# EAGLE schematic router (EAGLE 9.6.2)
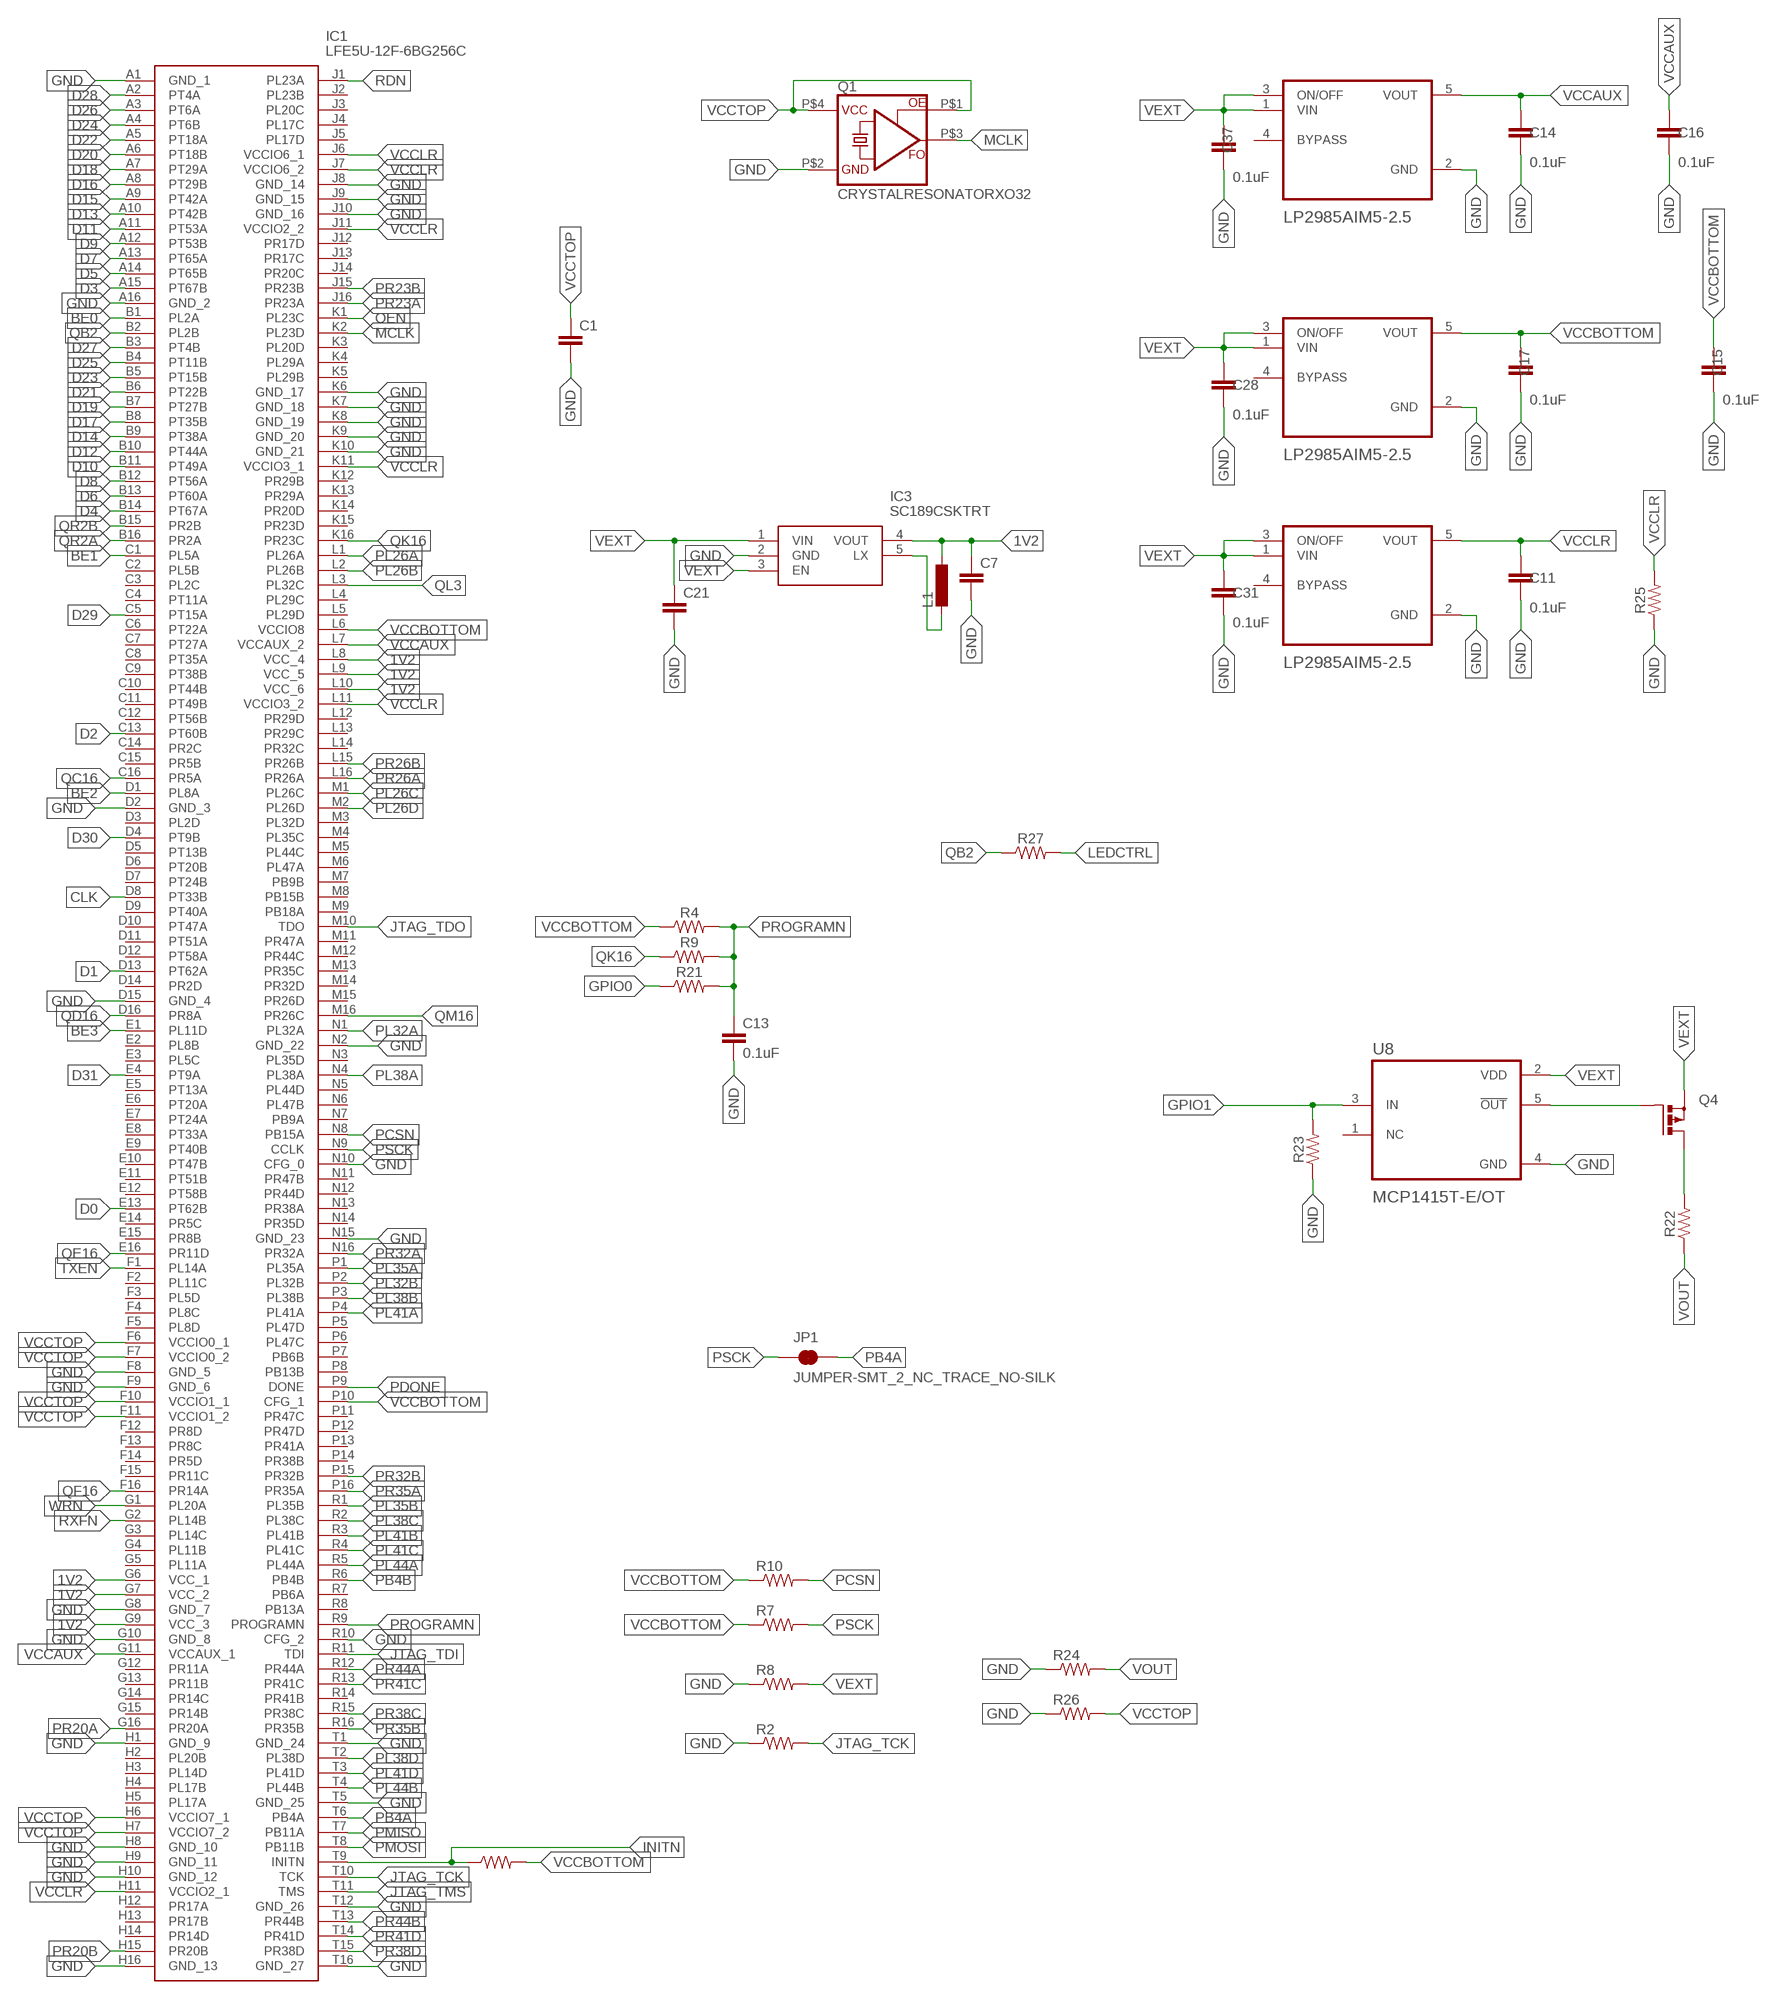
[diagram p0: schematic, sheet 1, part 1 of 3]
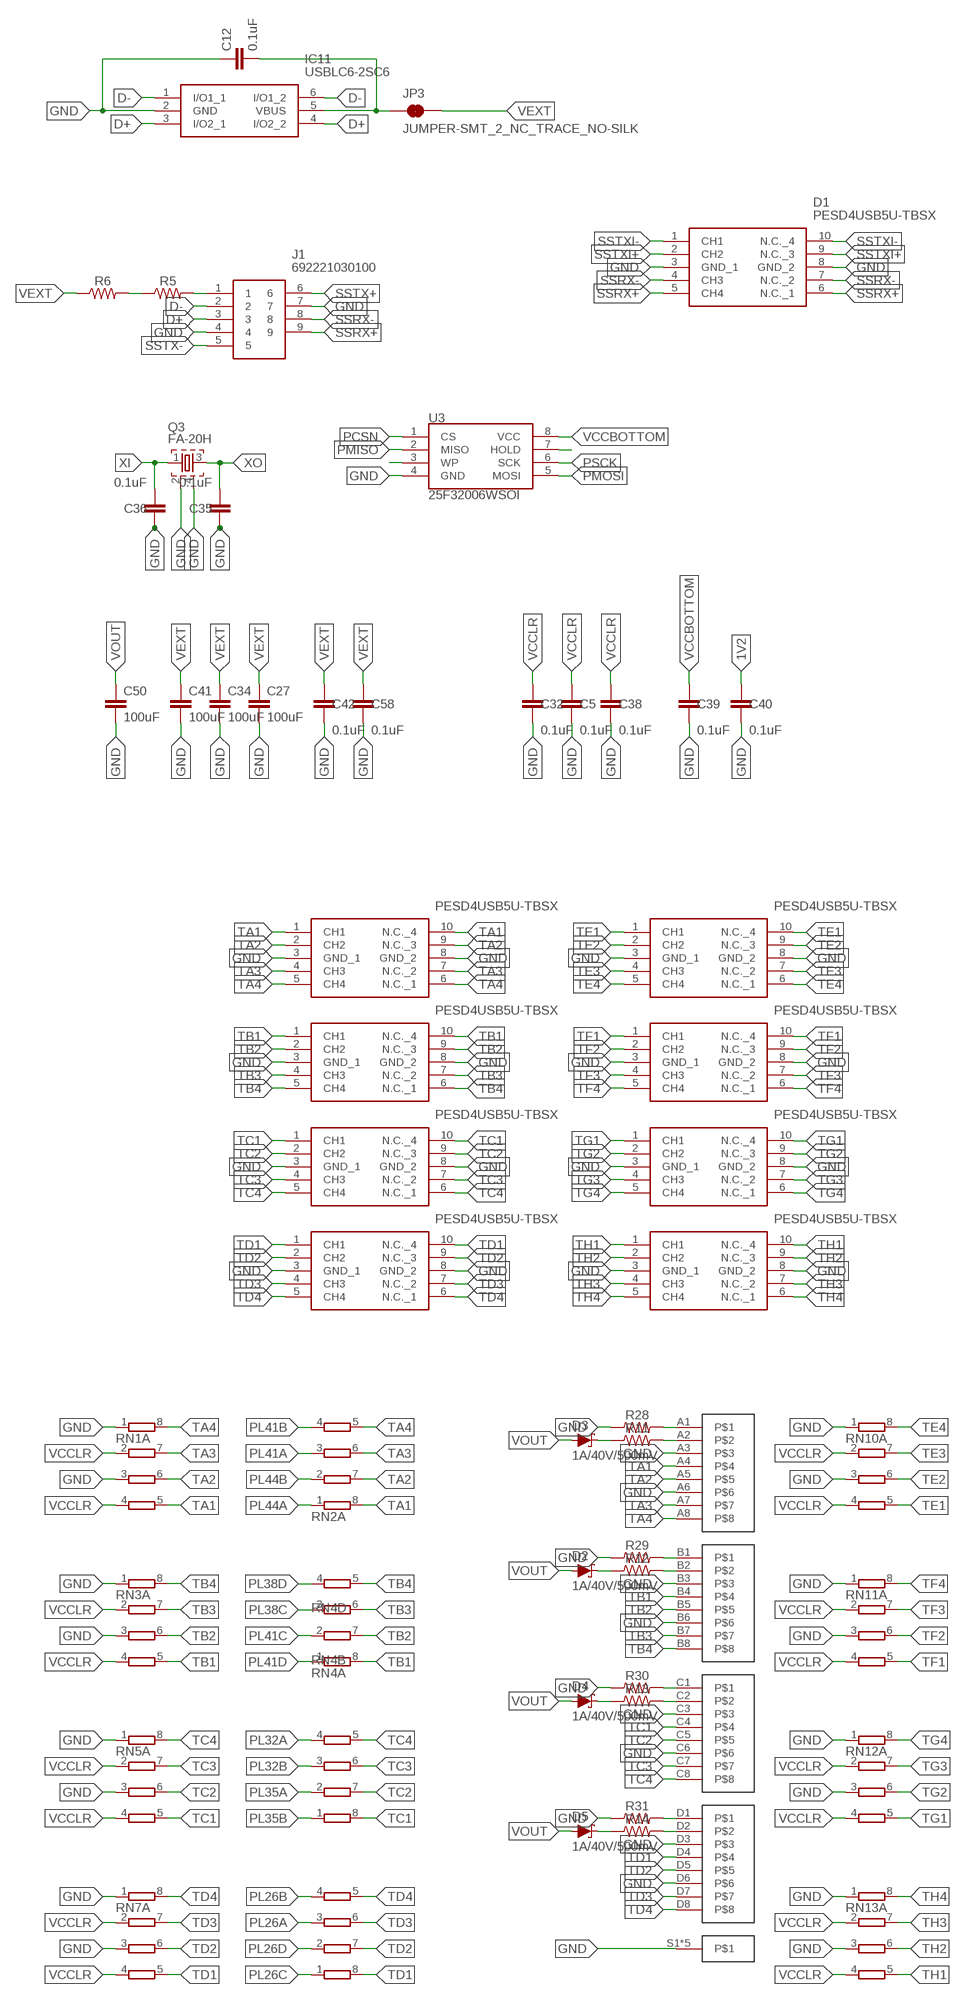
[diagram p1: schematic, sheet 1, part 2 of 3]
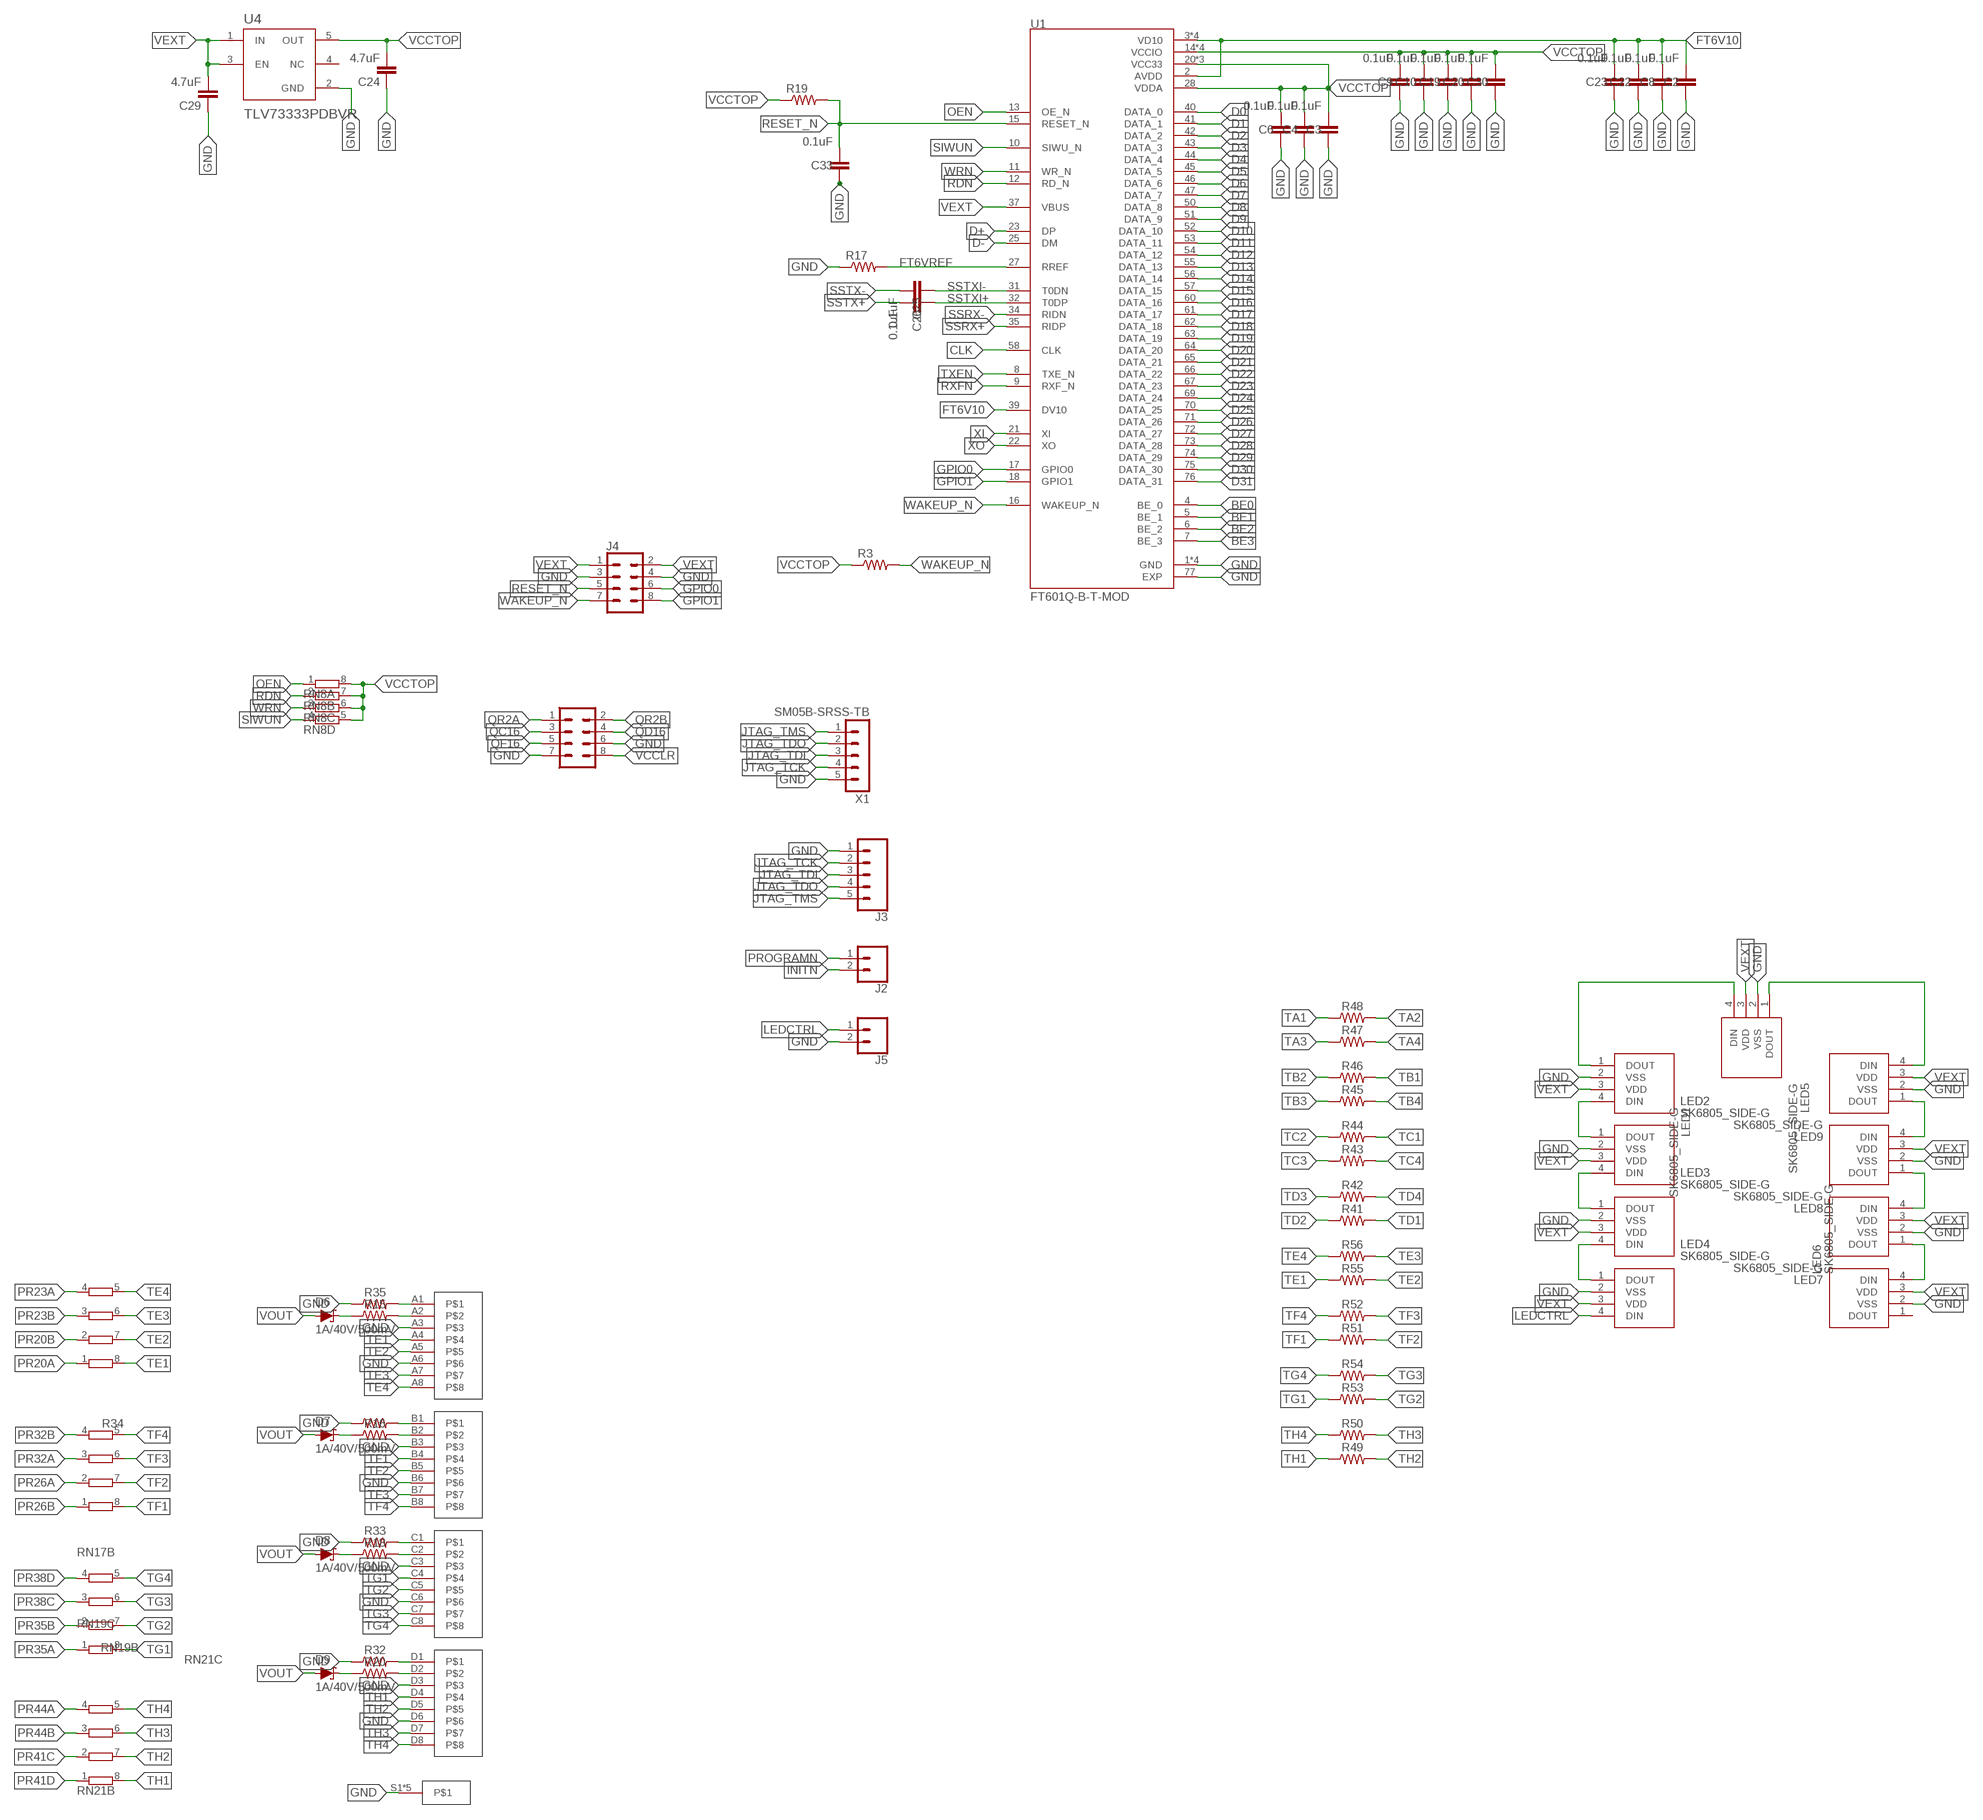
[diagram p2: schematic, sheet 1, part 3 of 3]

## Parts
C1  C-EUC0603  [C0603]
C2  0.1uF  0.1UF-0603-25V-5%  [0603]
C3  0.1uF  0.1UF-0603-25V-5%  [0603]
C4  0.1uF  0.1UF-0603-25V-5%  [0603]
C5  0.1uF  0.1UF-0603-25V-5%  [0603]
C6  0.1uF  0.1UF-0603-25V-5%  [0603]
C7  C-EUC0805  [C0805]
C8  0.1uF  0.1UF-0603-100V-10%  [0603]
C9  0.1uF  0.1UF-0603-100V-10%  [0603]
C10  0.1uF  0.1UF-0603-100V-10%  [0603]
C11  0.1uF  0.1UF-0603-25V-5%  [0603]
C12  0.1uF  0.1UF-0603-25V-(+80/-20%)  [0603]
C13  0.1uF  0.1UF-0603-25V-5%  [0603]
C14  0.1uF  0.1UF-0603-25V-5%  [0603]
C15  0.1uF  0.1UF-0603-25V-5%  [0603]
C16  0.1uF  0.1UF-0603-25V-5%  [0603]
C17  0.1uF  0.1UF-0603-25V-5%  [0603]
C19  0.1uF  0.1UF-0603-100V-10%  [0603]
C20  0.1uF  0.1UF-0603-100V-10%  [0603]
C21  C-EUC0805  [C0805]
C22  0.1uF  0.1UF-0603-25V-5%  [0603]
C23  0.1uF  0.1UF-0603-100V-10%  [0603]
C24  4.7uF  C-EUC0603  [C0603]
C25  0.1uF  0.1UF-0603-25V-5%  [0603]
C26  0.1uF  0.1UF-0603-25V-5%  [0603]
C27  100uF  C-EUC1210  [C1210]
C28  0.1uF  0.1UF-0603-25V-5%  [0603]
C29  4.7uF  C-EUC0603  [C0603]
C30  0.1uF  0.1UF-0603-100V-10%  [0603]
C31  0.1uF  0.1UF-0603-25V-5%  [0603]
C32  0.1uF  0.1UF-0603-25V-5%  [0603]
C33  0.1uF  0.1UF-0603-25V-5%  [0603]
C34  100uF  C-EUC1210  [C1210]
C35  0.1uF  0.1UF-0603-25V-5%  [0603]
C36  0.1uF  0.1UF-0603-25V-5%  [0603]
C37  0.1uF  0.1UF-0603-25V-5%  [0603]
C38  0.1uF  0.1UF-0603-25V-5%  [0603]
C39  0.1uF  0.1UF-0603-25V-5%  [0603]
C40  0.1uF  0.1UF-0603-25V-5%  [0603]
C41  100uF  C-EUC1210  [C1210]
C42  0.1uF  0.1UF-0603-25V-5%  [0603]
C50  100uF  C-EUC1210  [C1210]
C58  0.1uF  0.1UF-0603-25V-5%  [0603]
D1  PESD4USB5U-TBSX  [SON50P100X250X80-10N]
D2  1A/40V/500mV  DIODE-SCHOTTKY-SS14  [SMA-DIODE]
D3  1A/40V/500mV  DIODE-SCHOTTKY-SS14  [SMA-DIODE]
D4  1A/40V/500mV  DIODE-SCHOTTKY-SS14  [SMA-DIODE]
D5  1A/40V/500mV  DIODE-SCHOTTKY-SS14  [SMA-DIODE]
D6  1A/40V/500mV  DIODE-SCHOTTKY-SS14  [SMA-DIODE]
D7  1A/40V/500mV  DIODE-SCHOTTKY-SS14  [SMA-DIODE]
D8  1A/40V/500mV  DIODE-SCHOTTKY-SS14  [SMA-DIODE]
D9  1A/40V/500mV  DIODE-SCHOTTKY-SS14  [SMA-DIODE]
D10  PESD4USB5U-TBSX  [SON50P100X250X80-10N]
D11  PESD4USB5U-TBSX  [SON50P100X250X80-10N]
D12  PESD4USB5U-TBSX  [SON50P100X250X80-10N]
D13  PESD4USB5U-TBSX  [SON50P100X250X80-10N]
D14  PESD4USB5U-TBSX  [SON50P100X250X80-10N]
D15  PESD4USB5U-TBSX  [SON50P100X250X80-10N]
D16  PESD4USB5U-TBSX  [SON50P100X250X80-10N]
D17  PESD4USB5U-TBSX  [SON50P100X250X80-10N]
IC1  LFE5U-12F-6BG256C  [BGA256C80P16X16_1400X1400X170]
IC3  SC189CSKTRT  [SOT95P280X145-5N]
IC11  USBLC6-2SC6  [SOT95P280X145-6N]
J1  692221030100  [WR-COM_USB_TYPE_B]
J2  CONN_02  [1X02]
J3  CONN_05  [1X05]
J4  CONN_04X2  [2X4]
J5  CONN_02  [1X02]
J8  CONN_04X2  [2X4]
JP1  JUMPER-SMT_2_NC_TRACE_NO-SILK  [SMT-JUMPER_2_NC_TRACE_NO-SILK]
JP3  JUMPER-SMT_2_NC_TRACE_NO-SILK  [SMT-JUMPER_2_NC_TRACE_NO-SILK]
L1  L-EUL3230M  [L3230M]
LED1  SK6805_SIDE-G  [SK6805SIDEG]
LED2  SK6805_SIDE-G  [SK6805SIDEG]
LED3  SK6805_SIDE-G  [SK6805SIDEG]
LED4  SK6805_SIDE-G  [SK6805SIDEG]
LED5  SK6805_SIDE-G  [SK6805SIDEG]
LED6  SK6805_SIDE-G  [SK6805SIDEG]
LED7  SK6805_SIDE-G  [SK6805SIDEG]
LED8  SK6805_SIDE-G  [SK6805SIDEG]
LED9  SK6805_SIDE-G  [SK6805SIDEG]
Q1  CRYSTALRESONATORXO32  [XO32]
Q3  FA-20H  [FA-20H]
Q4  P-MOSFET-SO8  [SO-08]
R1  RESISTOR0603  [0603]
R2  RESISTOR0603  [0603]
R3  RESISTOR0603  [0603]
R4  RESISTOR0603  [0603]
R5  RESISTOR0805  [0805]
R6  RESISTOR0805  [0805]
R7  RESISTOR0603  [0603]
R8  RESISTOR0603  [0603]
R9  RESISTOR0603  [0603]
R10  RESISTOR0603  [0603]
R11  RESISTOR0805  [0805]
R12  RESISTOR0805  [0805]
R13  RESISTOR0805  [0805]
R14  RESISTOR0805  [0805]
R15  RESISTOR0805  [0805]
R16  RESISTOR0805  [0805]
R17  RESISTOR0603  [0603]
R18  RESISTOR0805  [0805]
R19  RESISTOR0603  [0603]
R20  RESISTOR0805  [0805]
R21  RESISTOR0603  [0603]
R22  RESISTOR1206  [1206]
R23  RESISTOR0603  [0603]
R24  RESISTOR0603  [0603]
R25  RESISTOR0603  [0603]
R26  RESISTOR0603  [0603]
R27  RESISTOR0603  [0603]
R28  RESISTOR0603  [0603]
R29  RESISTOR0603  [0603]
R30  RESISTOR0603  [0603]
R31  RESISTOR0603  [0603]
R32  RESISTOR0603  [0603]
R33  RESISTOR0603  [0603]
R34  RESISTOR0603  [0603]
R35  RESISTOR0603  [0603]
R41  RESISTOR0402  [0402]
R42  RESISTOR0402  [0402]
R43  RESISTOR0402  [0402]
R44  RESISTOR0402  [0402]
R45  RESISTOR0402  [0402]
R46  RESISTOR0402  [0402]
R47  RESISTOR0402  [0402]
R48  RESISTOR0402  [0402]
R49  RESISTOR0402  [0402]
R50  RESISTOR0402  [0402]
R51  RESISTOR0402  [0402]
R52  RESISTOR0402  [0402]
R53  RESISTOR0402  [0402]
R54  RESISTOR0402  [0402]
R55  RESISTOR0402  [0402]
R56  RESISTOR0402  [0402]
RN1  4R-NEXBV8V  [EXBV8V]
RN2  4R-NEXBV8V  [EXBV8V]
RN3  4R-NEXBV8V  [EXBV8V]
RN4  4R-NEXBV8V  [EXBV8V]
RN5  4R-NEXBV8V  [EXBV8V]
RN6  4R-NEXBV8V  [EXBV8V]
RN7  4R-NEXBV8V  [EXBV8V]
RN8  4R-NEXBV8V  [EXBV8V]
RN9  4R-NEXBV8V  [EXBV8V]
RN10  4R-NEXBV8V  [EXBV8V]
RN11  4R-NEXBV8V  [EXBV8V]
RN12  4R-NEXBV8V  [EXBV8V]
RN13  4R-NEXBV8V  [EXBV8V]
RN15  4R-NEXBV8V  [EXBV8V]
RN17  4R-NEXBV8V  [EXBV8V]
RN19  4R-NEXBV8V  [EXBV8V]
RN21  4R-NEXBV8V  [EXBV8V]
U1  FT601Q-B-T-MOD  [QFN40P900X900X100-77N-MOD]
U3  25F32006WSOI  SPI_FLASH-X25XXSMD1  [SO08-EIAJ]
U4  TLV73333PDBVR  [SOT95P280X145-5N]
U5  LP2985AIM5-2.5  [SOT95P280X145-5N]
U6  LP2985AIM5-2.5  [SOT95P280X145-5N]
U7  LP2985AIM5-2.5  [SOT95P280X145-5N]
U8  MCP1415T-E/OT  [SOT95P270X145-5N]
U$49  QUADRJ45  [ARJ14A-MESA-MU2_CONN_ARJ14A-MESA-MU2]
U$50  QUADRJ45  [ARJ14A-MESA-MU2_CONN_ARJ14A-MESA-MU2]
X1  SM05B-SRSS-TB  [SM05B-SRSS-TB]

## Nets
1V2: C7.1 C40.1 IC1.G6(VCC_1) IC1.G7(VCC_2) IC1.G9(VCC_3) IC1.L8(VCC_4) IC1.L9(VCC_5) IC1.L10(VCC_6) IC3.4(VOUT) L1.1
BE0: IC1.B1(PL2A) U1.4(BE_0)
BE1: IC1.C1(PL5A) U1.5(BE_1)
BE2: IC1.D1(PL8A) U1.6(BE_2)
BE3: IC1.E1(PL11D) U1.7(BE_3)
CLK: IC1.D8(PT33B) U1.58(CLK)
D0: IC1.E13(PT62B) U1.40(DATA_0)
D1: IC1.D13(PT62A) U1.41(DATA_1)
D2: IC1.C13(PT60B) U1.42(DATA_2)
D3: IC1.A15(PT67B) U1.43(DATA_3)
D4: IC1.B14(PT67A) U1.44(DATA_4)
D5: IC1.A14(PT65B) U1.45(DATA_5)
D6: IC1.B13(PT60A) U1.46(DATA_6)
D7: IC1.A13(PT65A) U1.47(DATA_7)
D8: IC1.B12(PT56A) U1.50(DATA_8)
D9: IC1.A12(PT53B) U1.51(DATA_9)
D10: IC1.B11(PT49A) U1.52(DATA_10)
D11: IC1.A11(PT53A) U1.53(DATA_11)
D12: IC1.B10(PT44A) U1.54(DATA_12)
D13: IC1.A10(PT42B) U1.55(DATA_13)
D14: IC1.B9(PT38A) U1.56(DATA_14)
D15: IC1.A9(PT42A) U1.57(DATA_15)
D16: IC1.A8(PT29B) U1.60(DATA_16)
D17: IC1.B8(PT35B) U1.61(DATA_17)
D18: IC1.A7(PT29A) U1.62(DATA_18)
D19: IC1.B7(PT27B) U1.63(DATA_19)
D20: IC1.A6(PT18B) U1.64(DATA_20)
D21: IC1.B6(PT22B) U1.65(DATA_21)
D22: IC1.A5(PT18A) U1.66(DATA_22)
D23: IC1.B5(PT15B) U1.67(DATA_23)
D24: IC1.A4(PT6B) U1.69(DATA_24)
D25: IC1.B4(PT11B) U1.70(DATA_25)
D26: IC1.A3(PT6A) U1.71(DATA_26)
D27: IC1.B3(PT4B) U1.72(DATA_27)
D28: IC1.A2(PT4A) U1.73(DATA_28)
D29: IC1.C5(PT15A) U1.74(DATA_29)
D30: IC1.D4(PT9B) U1.75(DATA_30)
D31: IC1.E4(PT9A) U1.76(DATA_31)
D+: IC11.3(I/O2_1) IC11.4(I/O2_2) J1.3 U1.23(DP)
D-: IC11.1(I/O1_1) IC11.6(I/O1_2) J1.2 U1.25(DM)
FT6V10: C2.2 C8.2 C22.2 C23.2 U1.2(AVDD) U1.3(VD10) U1.30(VD10) U1.33(VD10) U1.39(DV10) U1.48(VD10)
FT6VREF: R17.2 U1.27(RREF)
GND: C1.2 C2.1 C3.1 C4.1 C5.2 C6.1 C7.2 C8.1 C9.1 C10.1 C11.2 C12.1 C13.2 C14.2 C15.2 C16.2 C17.2 C19.1 C20.1 C21.2 C22.1 C23.1 C24.1 C27.2 C28.2 C29.1 C30.1 C31.2 C32.2 C33.1 C34.2 C35.1 C36.1 C37.2 C38.2 C39.2 C40.2 C41.2 C42.2 C50.2 C58.2 D1.3(GND_1) D1.8(GND_2) D10.3(GND_1) D10.8(GND_2) D11.3(GND_1) D11.8(GND_2) D12.3(GND_1) D12.8(GND_2) D13.3(GND_1) D13.8(GND_2) D14.3(GND_1) D14.8(GND_2) D15.3(GND_1) D15.8(GND_2) D16.3(GND_1) D16.8(GND_2) D17.3(GND_1) D17.8(GND_2) IC1.A1(GND_1) IC1.A16(GND_2) IC1.D2(GND_3) IC1.D15(GND_4) IC1.F8(GND_5) IC1.F9(GND_6) IC1.G8(GND_7) IC1.G10(GND_8) IC1.H1(GND_9) IC1.H8(GND_10) IC1.H9(GND_11) IC1.H10(GND_12) IC1.H16(GND_13) IC1.J8(GND_14) IC1.J9(GND_15) IC1.J10(GND_16) IC1.K6(GND_17) IC1.K7(GND_18) IC1.K8(GND_19) IC1.K9(GND_20) IC1.K10(GND_21) IC1.N2(GND_22) IC1.N10(CFG_0) IC1.N15(GND_23) IC1.R10(CFG_2) IC1.T1(GND_24) IC1.T5(GND_25) IC1.T12(GND_26) IC1.T16(GND_27) IC3.2(GND) IC11.2(GND) J1.4 J1.7 J3.1 J4.3 J4.4 J5.2 J8.6 J8.7 LED1.2(VSS) LED2.2(VSS) LED3.2(VSS) LED4.2(VSS) LED5.2(VSS) LED6.2(VSS) LED7.2(VSS) LED8.2(VSS) LED9.2(VSS) Q1.P$2(GND) Q3.2 Q3.4 R2.1 R8.1 R17.1 R23.1 R24.1 R25.1 R26.1 R28.1 R29.1 R30.1 R31.1 R32.1 R33.1 R34.1 R35.1 RN1.1 RN1.3 RN3.1 RN3.3 RN5.1 RN5.3 RN7.1 RN7.3 RN10.1 RN10.3 RN11.1 RN11.3 RN12.1 RN12.3 RN13.1 RN13.3 U1.1(GND) U1.26(GND) U1.29(GND) U1.36(GND) U1.77(EXP) U3.4(GND) U4.2(GND) U5.2(GND) U6.2(GND) U7.2(GND) U8.4(GND) U$49.A3 U$49.A6 U$49.B3 U$49.B6 U$49.C3 U$49.C6 U$49.D3 U$49.D6 U$49.S1 U$49.S2 U$49.S3 U$49.S4 U$49.S5 U$50.A3 U$50.A6 U$50.B3 U$50.B6 U$50.C3 U$50.C6 U$50.D3 U$50.D6 U$50.S1 U$50.S2 U$50.S3 U$50.S4 U$50.S5 X1.5
GPIO0: J4.6 R21.1 U1.17(GPIO0)
GPIO1: J4.8 R23.2 U1.18(GPIO1) U8.3(IN)
INITN: IC1.T9(INITN) J2.2 R1.1
JTAG_TCK: IC1.T10(TCK) J3.2 R2.2 X1.4
JTAG_TDI: IC1.R11(TDI) J3.3 X1.3
JTAG_TDO: IC1.M10(TDO) J3.4 X1.2
JTAG_TMS: IC1.T11(TMS) J3.5 X1.1
LEDCTRL: J5.1 LED4.4(DIN) R27.2
MCLK: IC1.K2(PL23D) Q1.P$3(FO)
N$1: R15.2 U$50.A2
N$2: R16.2 U$50.B2
N$3: IC3.5(LX) L1.2
N$4: R18.2 U$50.C2
N$5: R20.2 U$50.D2
N$6: R35.2 U$50.A1
N$7: C12.2 IC11.5(VBUS) JP3.1
N$8: R5.1 R6.2
N$9: J1.1 R5.2
N$10: Q4.4(G) U8.5(!OUT)
N$11: Q4.5(D) Q4.6(D) Q4.7(D) Q4.8(D) R22.2
N$12: R34.2 U$50.B1
N$13: R33.2 U$50.C1
N$14: LED1.4(DIN) LED2.1(DOUT)
N$15: R32.2 U$50.D1
N$16: R11.2 U$49.A2
N$17: R12.2 U$49.B2
N$18: R13.2 U$49.C2
N$19: LED2.4(DIN) LED3.1(DOUT)
N$20: U3.3(WP)
N$21: U3.7(HOLD)
N$22: R14.2 U$49.D2
N$23: LED3.4(DIN) LED4.1(DOUT)
N$24: R28.2 U$49.A1
N$25: LED6.4(DIN) LED7.1(DOUT)
N$26: D3.C R11.1
N$27: LED1.1(DOUT) LED5.4(DIN)
N$28: R29.2 U$49.B1
N$29: LED7.4(DIN) LED8.1(DOUT)
N$30: R30.2 U$49.C1
N$31: R31.2 U$49.D1
N$32: LED8.4(DIN) LED9.1(DOUT)
N$34: LED5.1(DOUT) LED9.4(DIN)
N$35: D2.C R12.1
N$39: D4.C R13.1
N$41: D5.C R14.1
N$47: D6.C R15.1
N$49: D7.C R16.1
N$51: D8.C R18.1
N$53: D9.C R20.1
OEN: IC1.K1(PL23C) RN8.1 U1.13(OE_N)
PB4A: IC1.T6(PB4A) JP1.2
PB4B: IC1.R6(PB4B)
PCSN: IC1.N8(PB15A) R10.2 U3.1(CS)
PDONE: IC1.P9(DONE)
PL26A: IC1.L1(PL26A) RN9.3
PL26B: IC1.L2(PL26B) RN9.4
PL26C: IC1.M1(PL26C) RN9.1
PL26D: IC1.M2(PL26D) RN9.2
PL32A: IC1.N1(PL32A) RN6.4
PL32B: IC1.P2(PL32B) RN6.3
PL35A: IC1.P1(PL35A) RN6.2
PL35B: IC1.R1(PL35B) RN6.1
PL38A: IC1.N4(PL38A)
PL38B: IC1.P3(PL38B)
PL38C: IC1.R2(PL38C) RN4.3
PL38D: IC1.T2(PL38D) RN4.4
PL41A: IC1.P4(PL41A) RN2.3
PL41B: IC1.R3(PL41B) RN2.4
PL41C: IC1.R4(PL41C) RN4.2
PL41D: IC1.T3(PL41D) RN4.1
PL44A: IC1.R5(PL44A) RN2.1
PL44B: IC1.T4(PL44B) RN2.2
PMISO: IC1.T7(PB11A) U3.2(MISO)
PMOSI: IC1.T8(PB11B) U3.5(MOSI)
PR20A: IC1.G16(PR20A) RN15.1
PR20B: IC1.H15(PR20B) RN15.2
PR23A: IC1.J16(PR23A) RN15.4
PR23B: IC1.J15(PR23B) RN15.3
PR26A: IC1.L16(PR26A) RN17.2
PR26B: IC1.L15(PR26B) RN17.1
PR32A: IC1.N16(PR32A) RN17.3
PR32B: IC1.P15(PR32B) RN17.4
PR35A: IC1.P16(PR35A) RN19.1
PR35B: IC1.R16(PR35B) RN19.2
PR38C: IC1.R15(PR38C) RN19.3
PR38D: IC1.T15(PR38D) RN19.4
PR41C: IC1.R13(PR41C) RN21.2
PR41D: IC1.T14(PR41D) RN21.1
PR44A: IC1.R12(PR44A) RN21.4
PR44B: IC1.T13(PR44B) RN21.3
PROGRAMN: C13.1 IC1.R9(PROGRAMN) J2.1 R4.2 R9.2 R21.2
PSCK: IC1.N9(CCLK) JP1.1 R7.2 U3.6(SCK)
QB2: IC1.B2(PL2B) R27.1
QC16: IC1.C16(PR5A) J8.3
QD16: IC1.D16(PR8A) J8.4
QE16: IC1.E16(PR11D)
QF16: IC1.F16(PR14A) J8.5
QK16: IC1.K16(PR23C) R9.1
QL3: IC1.L3(PL32C)
QM16: IC1.M16(PR26C)
QR2A: IC1.B16(PR2A) J8.1
QR2B: IC1.B15(PR2B) J8.2
RDN: IC1.J1(PL23A) RN8.2 U1.12(RD_N)
RESET_N: C33.2 J4.5 R19.2 U1.15(RESET_N)
RXFN: IC1.G2(PL14B) U1.9(RXF_N)
SIWUN: RN8.4 U1.10(SIWU_N)
SSRX+: D1.5(CH4) D1.6(N.C._1) J1.9 U1.35(RIDP)
SSRX-: D1.4(CH3) D1.7(N.C._2) J1.8 U1.34(RIDN)
SSTX+: C26.2 J1.6
SSTX-: C25.2 J1.5
SSTXI+: C26.1 D1.2(CH2) D1.9(N.C._3) U1.32(T0DP)
SSTXI-: C25.1 D1.1(CH1) D1.10(N.C._4) U1.31(T0DN)
TA1: D10.1(CH1) D10.10(N.C._4) R48.1 RN1.5 RN2.8 U$49.A4
TA2: D10.2(CH2) D10.9(N.C._3) R48.2 RN1.6 RN2.7 U$49.A5
TA3: D10.4(CH3) D10.7(N.C._2) R47.1 RN1.7 RN2.6 U$49.A7
TA4: D10.5(CH4) D10.6(N.C._1) R47.2 RN1.8 RN2.5 U$49.A8
TB1: D11.1(CH1) D11.10(N.C._4) R46.2 RN3.5 RN4.8 U$49.B4
TB2: D11.2(CH2) D11.9(N.C._3) R46.1 RN3.6 RN4.7 U$49.B5
TB3: D11.4(CH3) D11.7(N.C._2) R45.1 RN3.7 RN4.6 U$49.B7
TB4: D11.5(CH4) D11.6(N.C._1) R45.2 RN3.8 RN4.5 U$49.B8
TC1: D12.1(CH1) D12.10(N.C._4) R44.2 RN5.5 RN6.8 U$49.C4
TC2: D12.2(CH2) D12.9(N.C._3) R44.1 RN5.6 RN6.7 U$49.C5
TC3: D12.4(CH3) D12.7(N.C._2) R43.1 RN5.7 RN6.6 U$49.C7
TC4: D12.5(CH4) D12.6(N.C._1) R43.2 RN5.8 RN6.5 U$49.C8
TD1: D13.1(CH1) D13.10(N.C._4) R41.2 RN7.5 RN9.8 U$49.D4
TD2: D13.2(CH2) D13.9(N.C._3) R41.1 RN7.6 RN9.7 U$49.D5
TD3: D13.4(CH3) D13.7(N.C._2) R42.1 RN7.7 RN9.6 U$49.D7
TD4: D13.5(CH4) D13.6(N.C._1) R42.2 RN7.8 RN9.5 U$49.D8
TE1: D14.1(CH1) D14.10(N.C._4) R55.1 RN10.5 RN15.8 U$50.A4
TE2: D14.2(CH2) D14.9(N.C._3) R55.2 RN10.6 RN15.7 U$50.A5
TE3: D14.4(CH3) D14.7(N.C._2) R56.2 RN10.7 RN15.6 U$50.A7
TE4: D14.5(CH4) D14.6(N.C._1) R56.1 RN10.8 RN15.5 U$50.A8
TF1: D15.1(CH1) D15.10(N.C._4) R51.1 RN11.5 RN17.8 U$50.B4
TF2: D15.2(CH2) D15.9(N.C._3) R51.2 RN11.6 RN17.7 U$50.B5
TF3: D15.4(CH3) D15.7(N.C._2) R52.2 RN11.7 RN17.6 U$50.B7
TF4: D15.5(CH4) D15.6(N.C._1) R52.1 RN11.8 RN17.5 U$50.B8
TG1: D16.1(CH1) D16.10(N.C._4) R53.1 RN12.5 RN19.8 U$50.C4
TG2: D16.2(CH2) D16.9(N.C._3) R53.2 RN12.6 RN19.7 U$50.C5
TG3: D16.4(CH3) D16.7(N.C._2) R54.2 RN12.7 RN19.6 U$50.C7
TG4: D16.5(CH4) D16.6(N.C._1) R54.1 RN12.8 RN19.5 U$50.C8
TH1: D17.1(CH1) D17.10(N.C._4) R49.1 RN13.5 RN21.8 U$50.D4
TH2: D17.2(CH2) D17.9(N.C._3) R49.2 RN13.6 RN21.7 U$50.D5
TH3: D17.4(CH3) D17.7(N.C._2) R50.2 RN13.7 RN21.6 U$50.D7
TH4: D17.5(CH4) D17.6(N.C._1) R50.1 RN13.8 RN21.5 U$50.D8
TXEN: IC1.F1(PL14A) U1.8(TXE_N)
VCCAUX: C14.1 C16.1 IC1.G11(VCCAUX_1) IC1.L7(VCCAUX_2) U6.5(VOUT)
VCCBOTTOM: C15.1 C17.1 C39.1 IC1.L6(VCCIO8) IC1.P10(CFG_1) R1.2 R4.1 R7.1 R10.1 U3.8(VCC) U7.5(VOUT)
VCCLR: C5.1 C11.1 C32.1 C38.1 IC1.H11(VCCIO2_1) IC1.J6(VCCIO6_1) IC1.J7(VCCIO6_2) IC1.J11(VCCIO2_2) IC1.K11(VCCIO3_1) IC1.L11(VCCIO3_2) J8.8 R25.2 RN1.2 RN1.4 RN3.2 RN3.4 RN5.2 RN5.4 RN7.2 RN7.4 RN10.2 RN10.4 RN11.2 RN11.4 RN12.2 RN12.4 RN13.2 RN13.4 U5.5(VOUT)
VCCTOP: C1.1 C3.2 C4.2 C6.2 C9.2 C10.2 C19.2 C20.2 C24.2 C30.2 IC1.F6(VCCIO0_1) IC1.F7(VCCIO0_2) IC1.F10(VCCIO1_1) IC1.F11(VCCIO1_2) IC1.H6(VCCIO7_1) IC1.H7(VCCIO7_2) Q1.P$1(OE) Q1.P$4(VCC) R3.1 R19.1 R26.2 RN8.5 RN8.6 RN8.7 RN8.8 U1.14(VCCIO) U1.20(VCC33) U1.24(VCC33) U1.28(VDDA) U1.38(VCC33) U1.49(VCCIO) U1.59(VCCIO) U1.68(VCCIO) U4.5(OUT)
VEXT: C21.1 C27.1 C28.1 C29.2 C31.1 C34.1 C37.1 C41.1 C42.1 C58.1 IC3.1(VIN) IC3.3(EN) J4.1 J4.2 JP3.2 LED1.3(VDD) LED2.3(VDD) LED3.3(VDD) LED4.3(VDD) LED5.3(VDD) LED6.3(VDD) LED7.3(VDD) LED8.3(VDD) LED9.3(VDD) Q4.1(S) Q4.2(S) Q4.3(S) R6.1 R8.2 U1.37(VBUS) U4.1(IN) U4.3(EN) U5.1(VIN) U5.3(ON/OFF) U6.1(VIN) U6.3(ON/OFF) U7.1(VIN) U7.3(ON/OFF) U8.2(VDD)
VOUT: C50.1 D2.A D3.A D4.A D5.A D6.A D7.A D8.A D9.A R22.1 R24.2
WAKEUP_N: J4.7 R3.2 U1.16(WAKEUP_N)
WRN: IC1.G1(PL20A) RN8.3 U1.11(WR_N)
XI: C36.2 Q3.1 U1.21(XI)
XO: C35.2 Q3.3 U1.22(XO)
Unconnected: IC1.C2(PL5B) IC1.C3(PL2C) IC1.C4(PT11A) IC1.C6(PT22A) IC1.C7(PT27A) IC1.C8(PT35A) IC1.C9(PT38B) IC1.C10(PT44B) IC1.C11(PT49B) IC1.C12(PT56B) IC1.C14(PR2C) IC1.C15(PR5B) IC1.D3(PL2D) IC1.D5(PT13B) IC1.D6(PT20B) IC1.D7(PT24B) IC1.D9(PT40A) IC1.D10(PT47A) IC1.D11(PT51A) IC1.D12(PT58A) IC1.D14(PR2D) IC1.E2(PL8B) IC1.E3(PL5C) IC1.E5(PT13A) IC1.E6(PT20A) IC1.E7(PT24A) IC1.E8(PT33A) IC1.E9(PT40B) IC1.E10(PT47B) IC1.E11(PT51B) IC1.E12(PT58B) IC1.E14(PR5C) IC1.E15(PR8B) IC1.F2(PL11C) IC1.F3(PL5D) IC1.F4(PL8C) IC1.F5(PL8D) IC1.F12(PR8D) IC1.F13(PR8C) IC1.F14(PR5D) IC1.F15(PR11C) IC1.G3(PL14C) IC1.G4(PL11B) IC1.G5(PL11A) IC1.G12(PR11A) IC1.G13(PR11B) IC1.G14(PR14C) IC1.G15(PR14B) IC1.H2(PL20B) IC1.H3(PL14D) IC1.H4(PL17B) IC1.H5(PL17A) IC1.H12(PR17A) IC1.H13(PR17B) IC1.H14(PR14D) IC1.J2(PL23B) IC1.J3(PL20C) IC1.J4(PL17C) IC1.J5(PL17D) IC1.J12(PR17D) IC1.J13(PR17C) IC1.J14(PR20C) IC1.K3(PL20D) IC1.K4(PL29A) IC1.K5(PL29B) IC1.K12(PR29B) IC1.K13(PR29A) IC1.K14(PR20D) IC1.K15(PR23D) IC1.L4(PL29C) IC1.L5(PL29D) IC1.L12(PR29D) IC1.L13(PR29C) IC1.L14(PR32C) IC1.M3(PL32D) IC1.M4(PL35C) IC1.M5(PL44C) IC1.M6(PL47A) IC1.M7(PB9B) IC1.M8(PB15B) IC1.M9(PB18A) IC1.M11(PR47A) IC1.M12(PR44C) IC1.M13(PR35C) IC1.M14(PR32D) IC1.M15(PR26D) IC1.N3(PL35D) IC1.N5(PL44D) IC1.N6(PL47B) IC1.N7(PB9A) IC1.N11(PR47B) IC1.N12(PR44D) IC1.N13(PR38A) IC1.N14(PR35D) IC1.P5(PL47D) IC1.P6(PL47C) IC1.P7(PB6B) IC1.P8(PB13B) IC1.P11(PR47C) IC1.P12(PR47D) IC1.P13(PR41A) IC1.P14(PR38B) IC1.R7(PB6A) IC1.R8(PB13A) IC1.R14(PR41B) LED6.1(DOUT) U4.4(NC) U5.4(BYPASS) U6.4(BYPASS) U7.4(BYPASS) U8.1(NC)

## Library data of the parts
C1 C7 C21 = resistor:C-EU: CAPACITOR, European symbol
C2-C6 C11 C13-C17 C22 C25 C26 C28 C31-C33 C35-C40 C42 C58 = SparkFun-Capacitors:0.1UF: 0.1µF ceramic capacitors A capacitor is a passive two-terminal electrical component used to store electrical energy temporarily in an electric field.; PROD_ID: CAP-08604
C8-C10 C19 C20 C23 C30 = SparkFun-Capacitors:0.1UF: 0.1µF ceramic capacitors A capacitor is a passive two-terminal electrical component used to store electrical energy temporarily in an electric field.; PROD_ID: CAP-08390
C12 = SparkFun-Capacitors:0.1UF: 0.1µF ceramic capacitors A capacitor is a passive two-terminal electrical component used to store electrical energy temporarily in an electric field.; PROD_ID: CAP-00810
C24 C27 C29 C34 C41 C50 = rcl:C-EU: CAPACITOR, European symbol; SPICEPREFIX: C
D1 D10-D17 = PESD4USB5U-TBSX:PESD4USB5U-TBSX: ESD Suppressors / TVS Diodes TVS DIODES Source: Datasheet <https://assets.nexperia.com/documents/data-sheet/PESD4USB5U-TBS.pdf>; DESCRIPTION: ESD Suppressors / TVS Diodes TVS DIODES; HEIGHT: 0.8mm; MANUFACTURER_NAME: Nexperia; MANUFACTURER_PART_NUMBER: PESD4USB5U-TBSX; MOUSER_PART_NUMBER: 771-PESD4USB5U-TBSX; MOUSER_PRICE-STOCK: https://www.mouser.co.uk/ProductDetail/Nexperia/PESD4USB5U-TBSX?qs=ljCeji4nMDmlBRiGiyUt1A%3D%3D
D2-D9 = SparkFun-DiscreteSemi:DIODE-SCHOTTKY: Schottky diode A Schottky diode is a semiconductor diode which has a low forward voltage drop and a very fast switching action.; PROD_ID: DIO-08053
IC1 = LFE5U-12F-6BG256C:LFE5U-12F-6BG256C: FPGA - Field Programmable Gate Array ECP5; 12k LUTs; 1.1V Source: Datasheet <http://www.latticesemi.com/-/media/LatticeSemi/Documents/DataSheets/ECP5/FPGA-DS-02012-1-9-ECP5-ECP5G-Family-Data-Sheet.ashx?document_id=50461> Check prices <https://pricing.snapeda.com/parts/LFE5U-12F-6BG256C/Lattice%20Semiconductor/view-part?ref=eda>; AVAILABILITY: Warning; DESCRIPTION: ECP5 Field Programmable Gate Array (FPGA) IC 197 589824 12000 256-LFBGA; MF: Lattice Semiconductor; MP: LFE5U-12F-6BG256C; PACKAGE: CABGA-256 Lattice Semiconductor; PRICE: None; PURCHASE-URL: https://pricing.snapeda.com/search/part/LFE5U-12F-6BG256C/?ref=eda
IC3 = SC189CSKTRT:SC189CSKTRT: Conv DC-DC 2.9V to 5.5V Synchronous Step Down Single-Out 1.2V 1.5A 6-Pin MLPD-UT T/R Source: Datasheet <https://datasheet.datasheetarchive.com/originals/distributors/Datasheets-DGA14/1272982.pdf>; ARROW_PART_NUMBER: SC189CSKTRT; ARROW_PRICE-STOCK: https://www.arrow.com/en/products/sc189csktrt/semtech; DESCRIPTION: Conv DC-DC 2.9V to 5.5V Synchronous Step Down Single-Out 1.2V 1.5A 6-Pin MLPD-UT T/R; HEIGHT: 1.45mm; MANUFACTURER_NAME: SEMTECH; MANUFACTURER_PART_NUMBER: SC189CSKTRT; MOUSER_PART_NUMBER: 947-SC189CSKTRT; MOUSER_PRICE-STOCK: https://www.mouser.co.uk/ProductDetail/Semtech/SC189CSKTRT?qs=rBWM4%252BvDhIcKNVCFfiXT%2Fw%3D%3D
IC11 = USBLC6-2SC6:USBLC6-2SC6: TVS Diode Array Uni-Directional USBLC6-2SC6 17V, SOT-23 6-Pin Source: Datasheet <http://www.st.com/st-web-ui/static/active/en/resource/technical/document/datasheet/CD00050750.pdf>; ARROW_PART_NUMBER: USBLC6-2SC6; ARROW_PRICE-STOCK: https://www.arrow.com/en/products/usblc6-2sc6/stmicroelectronics?region=nac; DESCRIPTION: TVS Diode Array Uni-Directional USBLC6-2SC6 17V, SOT-23 6-Pin; HEIGHT: 1.45mm; MANUFACTURER_NAME: STMicroelectronics; MANUFACTURER_PART_NUMBER: USBLC6-2SC6; MOUSER_PART_NUMBER: 511-USBLC6-2SC6; MOUSER_PRICE-STOCK: https://www.mouser.co.uk/ProductDetail/STMicroelectronics/USBLC6-2SC6?qs=po45yt2pPpu%2FhNIlwQdTlg%3D%3D
J1 = 692221030100:692221030100: WR-COM USB 3.0 Connector B horizontal Wurth Elektronik Right Angle PCB Mount Mount Female Version 3.0 Type B USB Connector, 30 V ac, 0.25A Source: Datasheet <http://katalog.we-online.de/em/datasheet/692221030100.pdf>; DESCRIPTION: WR-COM USB 3.0 Connector B horizontal Wurth Elektronik Right Angle PCB Mount Mount Female Version 3.0 Type B USB Connector, 30 V ac, 0.25A; HEIGHT: mm; MANUFACTURER_NAME: Wurth Elektronik; MANUFACTURER_PART_NUMBER: 692221030100; MOUSER_PART_NUMBER: 710-692221030100; MOUSER_PRICE-STOCK: https://www.mouser.co.uk/ProductDetail/Wurth-Elektronik/692221030100?qs=e5m3IbTHPW%2F1T4qlB0JfxA%3D%3D
J2 J5 = SparkFun-Connectors:CONN_02: Multi connection point. Often used as Generic Header-pin footprint for 0.1 inch spaced/style header connections On any of the 0.1 inch spaced packages, you can populate with these: Break Away Headers - Straight <https://www.sparkfun.com/products/116> (PRT-00116) Break Away Male Headers - Right Angle <https://www.sparkfun.com/products/553> (PRT-00553) Female Headers <https://www.sparkfun.com/products/115> (PRT-00115) Break Away Headers - Machine Pin <https://www.sparkfun.com/products/117> (PRT-00117) Break Away Female Headers - Swiss Machine Pin <https://www.sparkfun.com/products/743> (PRT-00743) For SCREWTERMINALS and SPRING TERMINALS visit here: Screw Terimnals on SparkFun.com <https://www.sparkfun.com/search/results?term=Screw+Terminals> (5mm/3.5mm/2.54mm spacing) This device is also useful as a general connection point to wire up your design to another part of your project. Our various solder wires solder well into these plated through hole pads. Hook-Up Wire - Assortment (Stranded, 22 AWG) <https://www.sparkfun.com/products/11375> (PRT-11375) Hook-Up Wire - Assortment (Solid Core, 22 AWG) <https://www.sparkfun.com/products/11367> (PRT-11367) View the entire wire category on our website here <https://www.sparkfun.com/categories/141> Special notes: Molex polarized connector foot print use with: PRT-08233 with associated crimp pins and housings. 2.54_SCREWTERM for use with PRT-10571. 3.5mm Screw Terminal footprints for PRT-08084 5mm Screw Terminal footprints for use with PRT-08432
J3 = SparkFun-Connectors:CONN_05: Multi connection point. Often used as Generic Header-pin footprint for 0.1 inch spaced/style header connections On any of the 0.1 inch spaced packages, you can populate with these: Break Away Headers - Straight <https://www.sparkfun.com/products/116> (PRT-00116) Break Away Male Headers - Right Angle <https://www.sparkfun.com/products/553> (PRT-00553) Female Headers <https://www.sparkfun.com/products/115> (PRT-00115) Break Away Headers - Machine Pin <https://www.sparkfun.com/products/117> (PRT-00117) Break Away Female Headers - Swiss Machine Pin <https://www.sparkfun.com/products/743> (PRT-00743) For SCREWTERMINALS and SPRING TERMINALS visit here: Screw Terimnals on SparkFun.com <https://www.sparkfun.com/search/results?term=Screw+Terminals> (5mm/3.5mm/2.54mm spacing) This device is also useful as a general connection point to wire up your design to another part of your project. Our various solder wires solder well into these plated through hole pads. Hook-Up Wire - Assortment (Stranded, 22 AWG) <https://www.sparkfun.com/products/11375> (PRT-11375) Hook-Up Wire - Assortment (Solid Core, 22 AWG) <https://www.sparkfun.com/products/11367> (PRT-11367) View the entire wire category on our website here <https://www.sparkfun.com/categories/141> Special notes: Molex polarized connector foot print use with SKU : PRT-08231 with associated crimp pins and housings. 1MM SMD Version SKU: PRT-10208
J4 J8 = SparkFun-Connectors:CONN_04X2: Multi connection point. Often used as Generic Header-pin footprint for 0.1 inch spaced/style header connections On any of the 0.1 inch spaced packages, you can populate with these: Break Away Headers - Straight <https://www.sparkfun.com/products/116> (PRT-00116) Break Away Male Headers - Right Angle <https://www.sparkfun.com/products/553> (PRT-00553) Female Headers <https://www.sparkfun.com/products/115> (PRT-00115) Break Away Headers - Machine Pin <https://www.sparkfun.com/products/117> (PRT-00117) Break Away Female Headers - Swiss Machine Pin <https://www.sparkfun.com/products/743> (PRT-00743)
JP1 JP3 = SparkFun-Jumpers:JUMPER-SMT_2_NC_TRACE: Normally closed trace jumper This jumper has a trace between two pads so it's normally closed (NC). Use a razor knife to open the connection. For best results follow the IPC guidelines for cutting traces: Cutout at least 0.063 mm (0.005 in). Remove all loose material to clean up the cut area. Seal the cut with an approved epoxy. Reapply solder to reclose the connection.
L1 = rcl:L-EU: INDUCTOR, European symbol; SPICEPREFIX: L
LED1-LED9 = SK6805_SIDE-G:SK6805_SIDE-G: SIDE-G 3512 LED Source: Datasheet <https://drive.google.com/file/d/14zRGkHF65mb-kswuIYE0wuO3upQk3szr/view?usp=sharing>; DESCRIPTION: SIDE-G 3512 LED; HEIGHT: 1.3mm; MANUFACTURER_NAME: Shenzhen Normand Electronic; MANUFACTURER_PART_NUMBER: SK6805 SIDE-G
Q1 = Crystals-new:CRYSTALRESONATOR
Q3 = crystal:FA-: MHz RANGE CRYSTAL UNIT Source: Epson Toyocom
Q4 = transistor-power:P-MOSFET-SO8: P-Channel MOSFET Example: FDS4435A; P-Channel Logic Level PowerTrench® MOSFET FDS4465; P-Channel 1.8V Specified PowerTrench® MOSFET Source: www.fairchildsemi.com
R1-R35 R41-R56 = SparkFun-Resistors:RESISTOR: Generic Resistor Package
RN1-RN13 RN15 RN17 RN19 RN21 = resistor-dil:4R-N: Array Chip Resistor Source: RS Component / Phycomp; OC_FARNELL: unknown; OC_NEWARK: unknown
U1 = FT601Q-B-T:FT601Q-B-T-MOD: USB3.0 to 32bit FIFO Interface Bridge QFN76 Tray Check availability <https://pricing.snapeda.com/parts/FT601Q-B-T/FTDI%2C%20Future/view-part?ref=eda>; AVAILABILITY: In Stock; DESCRIPTION: USB Bridge, USB to FIFO USB 3.0 FIFO Interface 76-QFN (9x9); MF: FTDI, Future; MP: FT601Q-B-T; PACKAGE: QFN-76 FTDI; PRICE: None; PURCHASE-URL: https://pricing.snapeda.com/search/part/FT601Q-B-T/?ref=eda
U3 = SparkFun-IC-Memory:SPI_FLASH-X25XX: 32M Serial Flash Memory 8pin SPI Flash series x25xx. Works with devices like W25X32 and BR25L32 Datasheet <http://www.macronix.com/Lists/Datasheet/Attachments/5031/MX25L3206E,%203V,%2032Mb,%20v1.5.pdf> SparkFun Products SparkFun Venus GPS Logger <https://www.sparkfun.com/products/10920> (GPS-10920); PROD_ID: IC-09109
U4 = TLV73333PDBVR:TLV73333PDBVR: 300-mA, capacitor-free, low-IQ, low-dropout voltage regulator with enable 5-SOT-23 -40 to 125 Check availability <https://pricing.snapeda.com/parts/TLV73333PDBVR/Texas%20Instruments/view-part?ref=eda>; AVAILABILITY: In Stock; DESCRIPTION: 300-mA, capacitor-free, low-IQ, low-dropout voltage regulator with enable; MF: Texas Instruments; MP: TLV73333PDBVR; PACKAGE: SOT-23-5 Texas Instruments; PRICE: None; PURCHASE-URL: https://pricing.snapeda.com/search/part/TLV73333PDBVR/?ref=eda
U5-U7 = LP2985AIM5-2.5:LP2985AIM5-2.5: Check prices <https://pricing.snapeda.com/parts/LP2985AIM5-2.5/NOPB/Texas%20Instruments/view-part?ref=eda>; AVAILABILITY: In Stock; DESCRIPTION: 150-mA, 16-V, low-dropout voltage regulator with enable 5-SOT-23 -40 to 125; MF: Texas Instruments; MP: LP2985AIM5-2.5/NOPB; PACKAGE: SOT-23-5 Texas Instruments; PRICE: None; PURCHASE-URL: https://pricing.snapeda.com/search/part/LP2985AIM5-2.5/NOPB/?ref=eda
U8 = MCP1415T-E_OT:MCP1415T-E/OT: Check prices <https://pricing.snapeda.com/parts/MCP1415T-E/OT/Microchip/view-part?ref=eda>; AVAILABILITY: In Stock; DESCRIPTION: Low-Side Gate Driver IC Inverting SOT-23-5; MF: Microchip; MP: MCP1415T-E/OT; PACKAGE: SOT-23-5 Microchip; PRICE: None; PURCHASE-URL: https://pricing.snapeda.com/search/part/MCP1415T-E/OT/?ref=eda
U$49 U$50 = routerboard32:QUADRJ45
X1 = con-JST SH (2):SM05B-SRSS: JST SH series header 1.00mm pitch disconnectable crimp style connectors, horizontal (side entry type), 5 pins